# Altium schematic sheet W5500.SchDoc
size A4; SheetNumber: 3; SheetTotal: 4
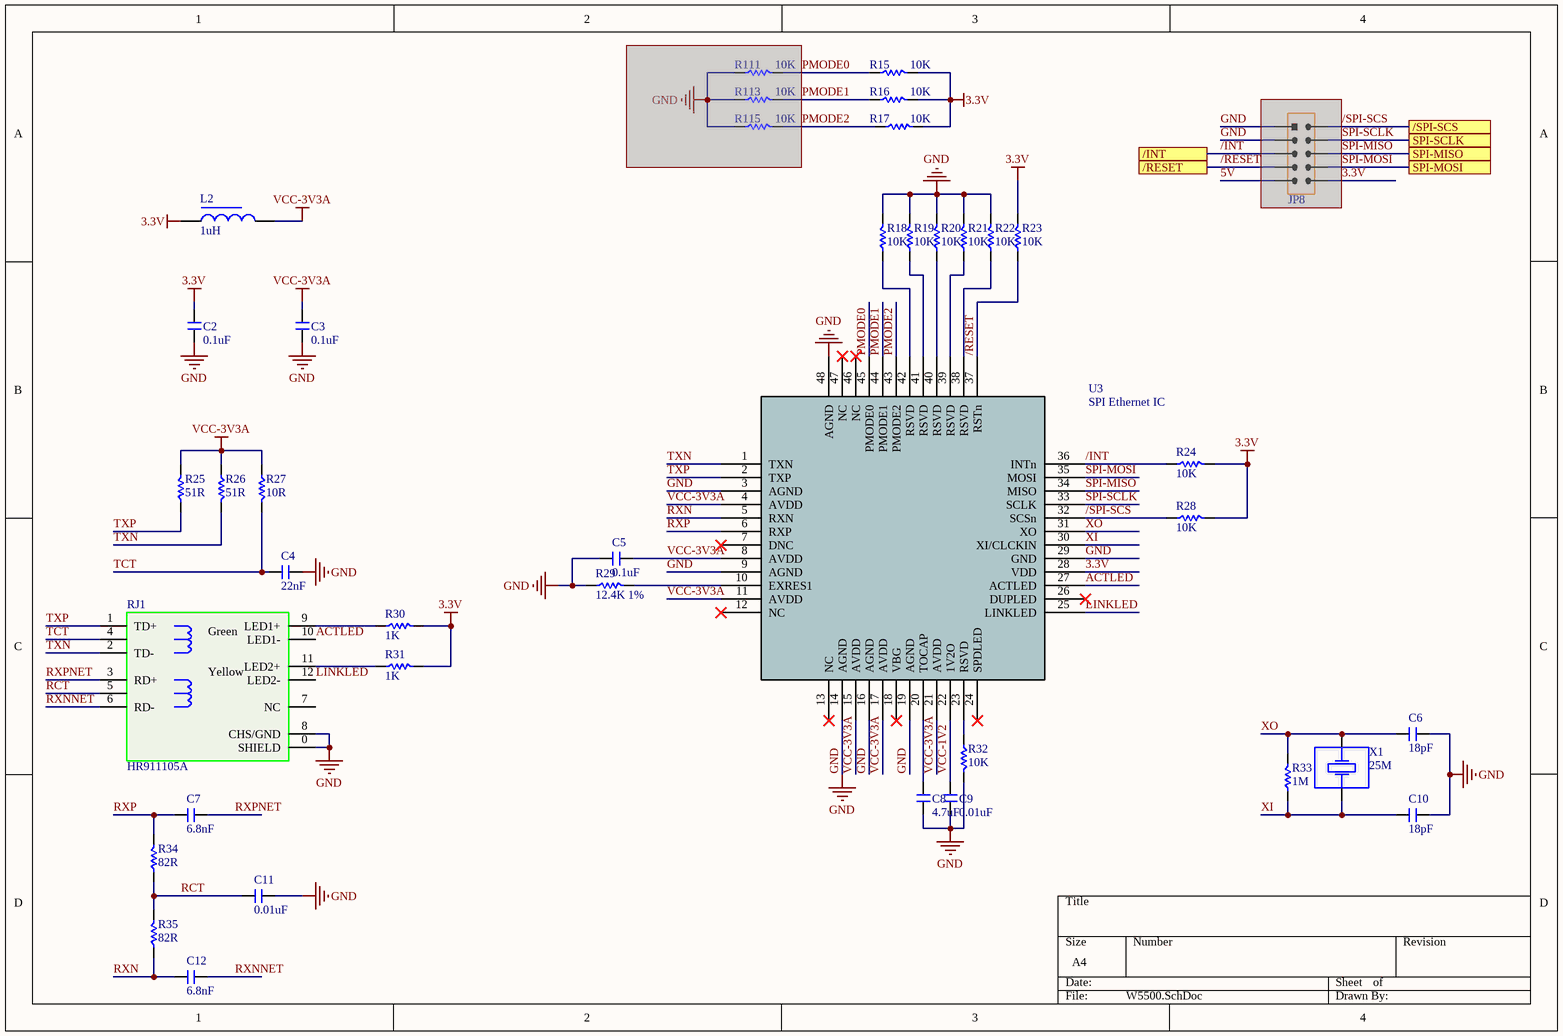
[diagram p0: W5500.SchDoc]

## Parts
C2  0.1uF  [C 0805]
C3  0.1uF  [C 0805]
C4  22nF  [C 0805]
C5  0.1uF  [C 0805]
C6  18pF  [C 0805]
C7  6.8nF  [C 0805]
C8  4.7uF  [C 0805]
C9  0.01uF  [C 0805]
C10  18pF  [C 0805]
C11  0.01uF  [C 0805]
C12  6.8nF  [C 0805]
JP8  Header 5X2  [HDR-5X2]  (value not drawn)  (masked out: inside a compile mask, not in the netlist)
L2  1uH  [L 0805]
R15  10K  [R 0805]
R16  10K  [R 0805]
R17  10K  [R 0805]
R18  10K  [R 0805]
R19  10K  [R 0805]
R20  10K  [R 0805]
R21  10K  [R 0805]
R22  10K  [R 0805]
R23  10K  [R 0805]
R24  10K  [R 0805]
R25  51R  [R 0805]
R26  51R  [R 0805]
R27  10R  [R 0805]
R28  10K  [R 0805]
R29  12.4K 1%  [R 0805]
R30  1K  [R 0805]
R31  1K  [R 0805]
R32  10K  [R 0805]
R33  1M  [R 0805]
R34  82R  [R 0805]
R35  82R  [R 0805]
R111  10K  [R 0805]  (masked out: inside a compile mask, not in the netlist)
R113  10K  [R 0805]  (masked out: inside a compile mask, not in the netlist)
R115  10K  [R 0805]  (masked out: inside a compile mask, not in the netlist)
RJ1  HR911105A  [RJ-45A12]
U3  SPI Ethernet IC  [LQFP48 7X7_L]
X1  25M  [XTAL-HC49S-THD]

## Ports
/INT, /RESET, /SPI-SCS, SPI-MISO, SPI-MOSI, SPI-SCLK

## Nets
3.3V: C2.2 L2.1 R15.2 R16.2 R17.2 R23.2 R24.2 R28.2 R30.2 R31.2 U3.28(VDD)
GND: C2.1 C3.1 C4.2 C5.1 C6.2 C8.2 C9.2 C10.2 C11.2 R18.2 R19.2 R20.2 R21.2 R22.2 R29.1 R32.2 RJ1.0(SHIELD) RJ1.8(CHS/GND) U3.3(AGND) U3.9(AGND) U3.14(AGND) U3.16(AGND) U3.19(AGND) U3.29(GND) U3.48(AGND)
VCC-3V3A: C3.2 C5.2 L2.2 R25.2 R26.1 R27.1 U3.4(AVDD) U3.8(AVDD) U3.11(AVDD) U3.15(AVDD) U3.17(AVDD) U3.21(AVDD)
/INT: R24.1 U3.36(INTn) ; port /INT
/RESET: R23.1 U3.37(RSTn) ; port /RESET
/SPI-SCS: R28.1 U3.32(SCSn)
ACTLED: RJ1.10(LED1-) U3.27(ACTLED)
LINKLED: RJ1.12(LED2-) U3.25(LINKLED)
PMODE0: U3.45(PMODE0)
PMODE1: U3.44(PMODE1)
PMODE2: U3.43(PMODE2)
RCT: C11.1 R34.1 R35.2 RJ1.5
RXN: C12.1 R35.1 U3.5(RXN)
RXNNET: C12.2 RJ1.6(RD-)
RXP: C7.1 R34.2 U3.6(RXP)
RXPNET: C7.2 RJ1.3(RD+)
SPI-MISO: U3.34(MISO)
SPI-MOSI: U3.35(MOSI)
SPI-SCLK: U3.33(SCLK)
TCT: C4.1 R27.2 RJ1.4
TXN: R26.2 RJ1.2(TD-) U3.1(TXN)
TXP: R25.1 RJ1.1(TD+) U3.2(TXP)
VCC-1V2: C9.1 U3.22(1V2O)
XI: C10.1 R33.1 U3.30(XI/CLCKIN) X1.1
XO: C6.1 R33.2 U3.31(XO) X1.2
NetC8_1: C8.1 U3.20(TOCAP)
NetR18_1: R18.1 U3.42(RSVD)
NetR19_1: R19.1 U3.41(RSVD)
NetR20_1: R20.1 U3.40(RSVD)
NetR21_1: R21.1 U3.39(RSVD)
NetR22_1: R22.1 U3.38(RSVD)
NetR29_2: R29.2 U3.10(EXRES1)
NetR30_1: R30.1 RJ1.9(LED1+)
NetR31_1: R31.1 RJ1.11(LED2+)
NetR32_1: R32.1 U3.23(RSVD)

Not connected (* = marked no-connect by the designer): R15 1; R16 1; R17 1; RJ1 7(NC); U3 7(DNC)* 12(NC)* 13(NC)* 18(VBG)* 24(SPDLED)* 26(DUPLED)* 46(NC)* 47(NC)*

## Notes on the sheet
- (in symbol HR911105A) Green; Yellow

## Library data of the parts
C2-C12 = C: Non-polar patch capacitor; BOM名称: 无极性贴片电容; 版权归属: 源创客; 学习资源: www.ooocke.com
JP8 = Header 5X2: 5*2P Connector; BOM名称: 5*2P接插件; 版权归属: 源创客; 学习资源: www.ooocke.com
L2 = L: Low power chip inductor; BOM名称: 小功率贴片电感; 版权归属: 源创客; 学习资源: www.ooocke.com
R15-R35 R111 R113 R115 = R: Chip resistor; 版权归属: 源创客; BOM名称: Chip resistor; 学习资源: www.ooocke.com
RJ1 = HR911105A: Illuminated Ethernet interface; BOM名称: 带灯以太网接口; 版权归属: 源创客; 学习资源: www.ooocke.com
U3 = W5500
X1 = XTAL-2: 2-Pin crystal; BOM名称: 2脚晶振; 版权归属: 源创客; 学习资源: www.ooocke.com